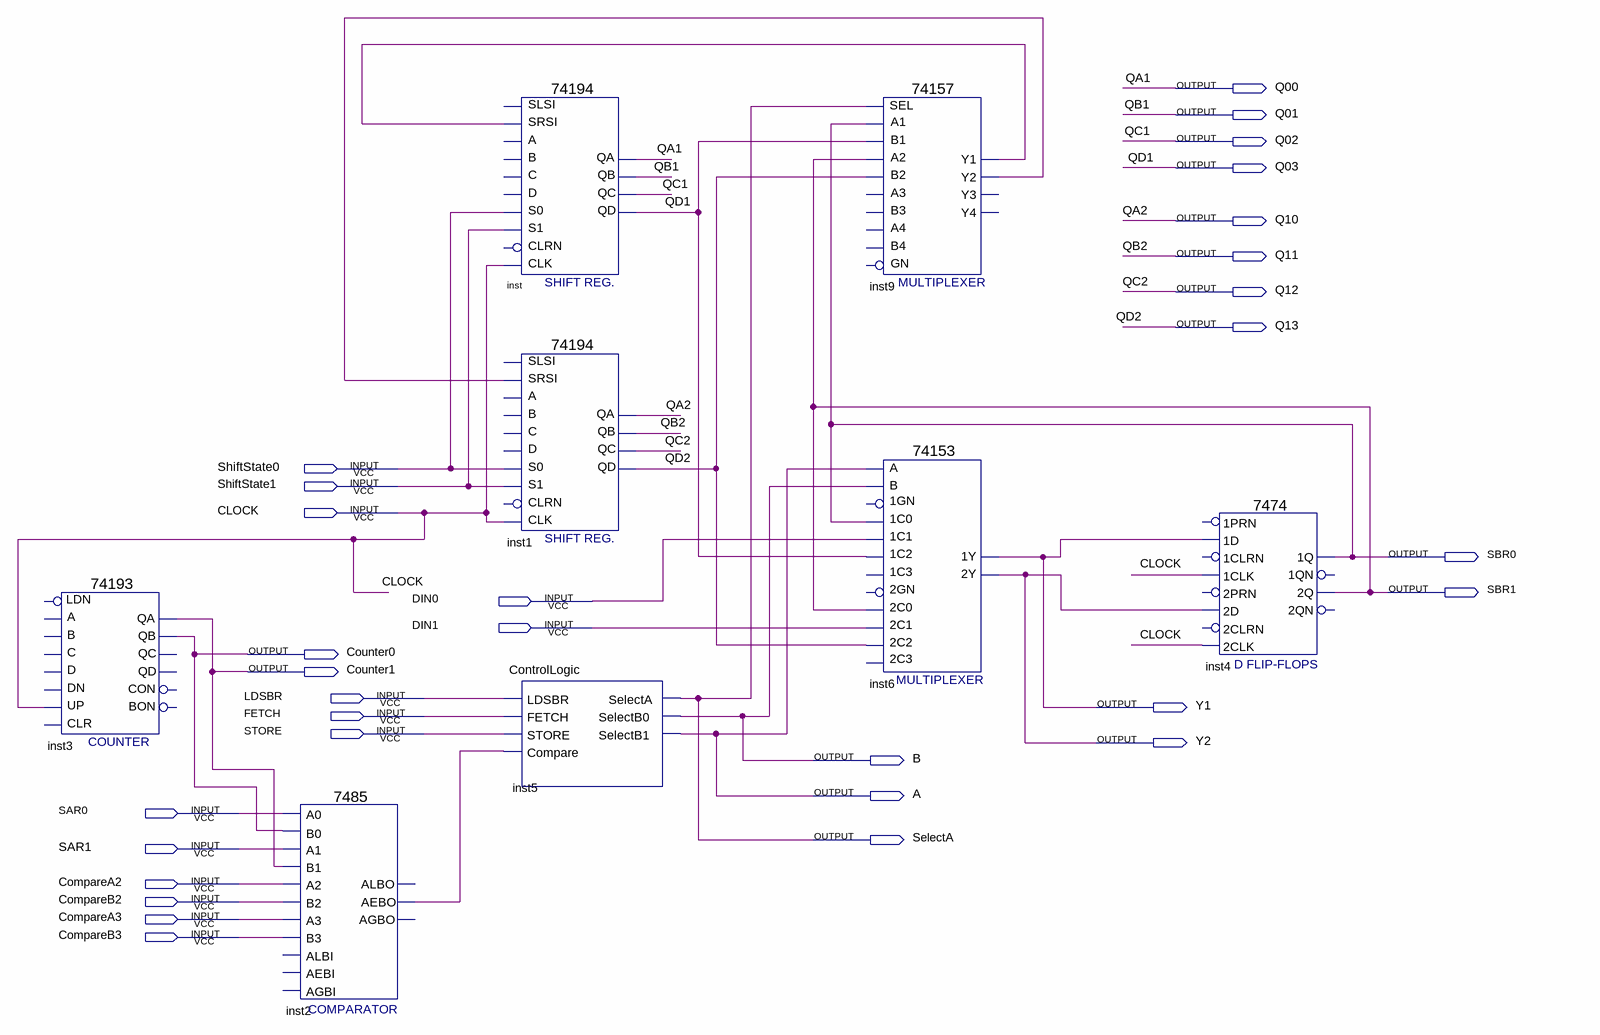
[diagram p0: schematic sheet]
// Quartus schematic Lab2.bdf as structural Verilog: 8 symbols, 31 pins
module Lab2 (
  input  ShiftState0,
  input  ShiftState1,
  input  CLOCK,
  input  DIN0,
  input  DIN1,
  input  LDSBR,
  input  FETCH,
  input  STORE,
  input  SAR0,
  input  SAR1,
  input  CompareA2,
  input  CompareB2,
  input  CompareA3,
  input  CompareB3,
  output Q00,
  output Q01,
  output Q02,
  output Q03,
  output Q10,
  output Q11,
  output Q12,
  output Q13,
  output SBR0,
  output SBR1,
  output Counter0,
  output Counter1,
  output Y1,
  output Y2,
  output B,
  output A,
  output SelectA
);

  wire inst2_aebo, inst9_y1, inst9_y2;

  \74193  inst3 (.UP(CLOCK), .QB(Counter0), .QA(Counter1));  // open: D, C, B, A, CLR, DN, LDN, CON, QD, QC, BON
  \7485  inst2 (
    .A3(CompareA3), .B2(CompareB2), .A2(CompareA2), .A0(SAR0), .B0(Counter0), .B3(CompareB3), .A1(SAR1),
    .B1(Counter1), .AEBO(inst2_aebo));  // open: AEBI, AGBI, ALBI, ALBO, AGBO
  \74194  inst (
    .SRSI(inst9_y1), .CLK(CLOCK), .S1(ShiftState1), .S0(ShiftState0), .QA(Q00), .QB(Q01), .QC(Q02), .QD(Q03));  // open: SLSI, B, C, CLRN, D, A
  \74194  inst1 (
    .SRSI(inst9_y2), .CLK(CLOCK), .S1(ShiftState1), .S0(ShiftState0), .QA(Q10), .QB(Q11), .QC(Q12), .QD(Q13));  // open: SLSI, B, C, CLRN, D, A
  ControlLogic inst5 (
    .LDSBR(LDSBR), .FETCH(FETCH), .STORE(STORE), .Compare(inst2_aebo), .SelectA(SelectA), .SelectB0(B),
    .SelectB1(A));
  \74157  inst9 (
    .A1(SBR0), .B1(Q03), .SEL(SelectA), .B2(Q13), .A2(SBR1), .Y2(inst9_y2), .Y1(inst9_y1));  // open: A3, B3, B4, GN, A4, Y4, Y3
  \74153  inst6 (
    .\1C1 (DIN0), .\1C0 (SBR0), .\2C0 (SBR1), .\2C2 (Q13), .\1C2 (Q03), .B(B), .A(A), .\2C1 (DIN1),
    .\1Y (Y1), .\2Y (Y2));  // open: 1GN, 2GN, 1C3, 2C3
  \7474  inst4 (
    .\2D (Y2), .\1CLK (CLOCK), .\1D (Y1), .\2CLK (CLOCK), .\2Q (SBR1), .\1Q (SBR0));  // open: 2PRN, 1PRN, 2CLRN, 1CLRN, 1QN, 2QN

  // Other names for the same wires on the sheet: QA1 = Q00; QA2 = Q10; QB1 = Q01; QB2 = Q11; QC1 = Q02; QC2 = Q12;
  //   QD1 = Q03; QD2 = Q13
endmodule
